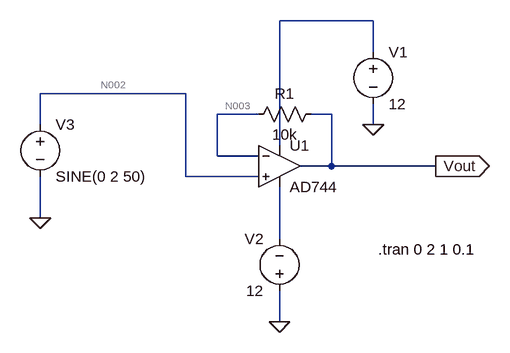
[diagram p0: schematic OpAmpVoltageFollower.asc]
OpAmpVoltageFollower.asc, the LTspice schematic file:
Version 4
SHEET 1 880 680
WIRE 400 48 256 48
WIRE 400 96 400 48
WIRE 112 160 -112 160
WIRE 224 192 160 192
WIRE 336 192 304 192
WIRE -112 208 -112 160
WIRE 400 208 400 176
WIRE 256 240 256 48
WIRE 160 256 160 192
WIRE 224 256 160 256
WIRE 336 272 336 192
WIRE 336 272 288 272
WIRE 496 272 336 272
WIRE 112 288 112 160
WIRE 224 288 112 288
WIRE -112 352 -112 288
WIRE 256 384 256 304
WIRE 256 512 256 464
FLAG -112 352 0
FLAG 400 208 0
FLAG 256 512 0
FLAG 496 272 Vout
IOPIN 496 272 Out
SYMBOL OpAmps/AD744 256 208 R0
SYMATTR InstName U1
SYMBOL voltage 400 80 R0
SYMATTR InstName V1
SYMATTR Value 12
SYMBOL voltage 256 480 R180
WINDOW 0 24 96 Left 2
WINDOW 3 24 16 Left 2
SYMATTR InstName V2
SYMATTR Value 12
SYMBOL voltage -112 192 R0
SYMATTR InstName V3
SYMATTR Value SINE(0 2 50)
SYMBOL res 320 176 R90
WINDOW 0 0 56 VBottom 2
WINDOW 3 32 56 VTop 2
SYMATTR InstName R1
SYMATTR Value 10k
TEXT 408 400 Left 2 !.tran 0 2 1 0.1

The netlist it stands for:
* OpAmpVoltageFollower.asc
XU1 N002 N003 N001 N004 Vout AD744  ; pins In+ In- V+ V- OUT
V1 N001 0 12
V2 0 N004 12
V3 N002 0 SINE(0 2 50)
R1 Vout N003 10k
.tran 0 2 1 0.1
.backanno
.end

* Results of the author's LTspice run, read from the files saved beside the schematic
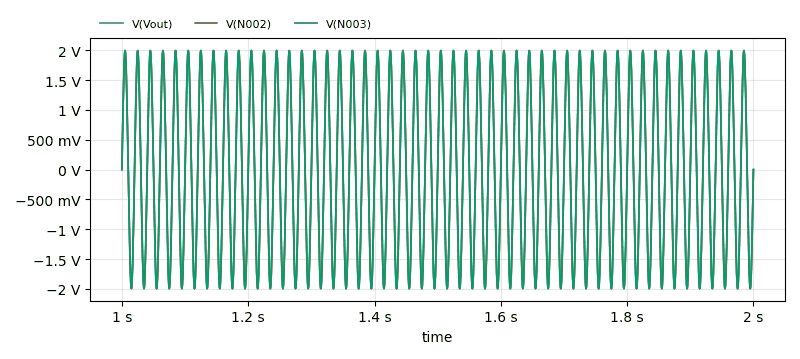
[diagram p1: Transient Analysis of OpAmpVoltageFollower.asc, plotted from the saved traces]
* Transient Analysis, 1 run:
*   V(Vout): min -1.994 V, max 1.994 V, average 26.09 µV, rms 1.412 V, last 11.18 µV
*   V(N002): min -1.999 V, max 2 V, average 18.94 µV, rms 1.437 V, last 0 V
*   V(N003): min -1.994 V, max 1.994 V, average 24.98 µV, rms 1.412 V, last -6.468 µV